# Altium schematic sheet Ticketing_Slave.SchDoc
size A4; Author: Mario Dos Santos; Organization: ETML-ES; Address1: Avenue Recordon 1; Address2: 1004 Lausanne; Address3: Switzerland; Revision: C; SheetNumber: 1; SheetTotal: 5
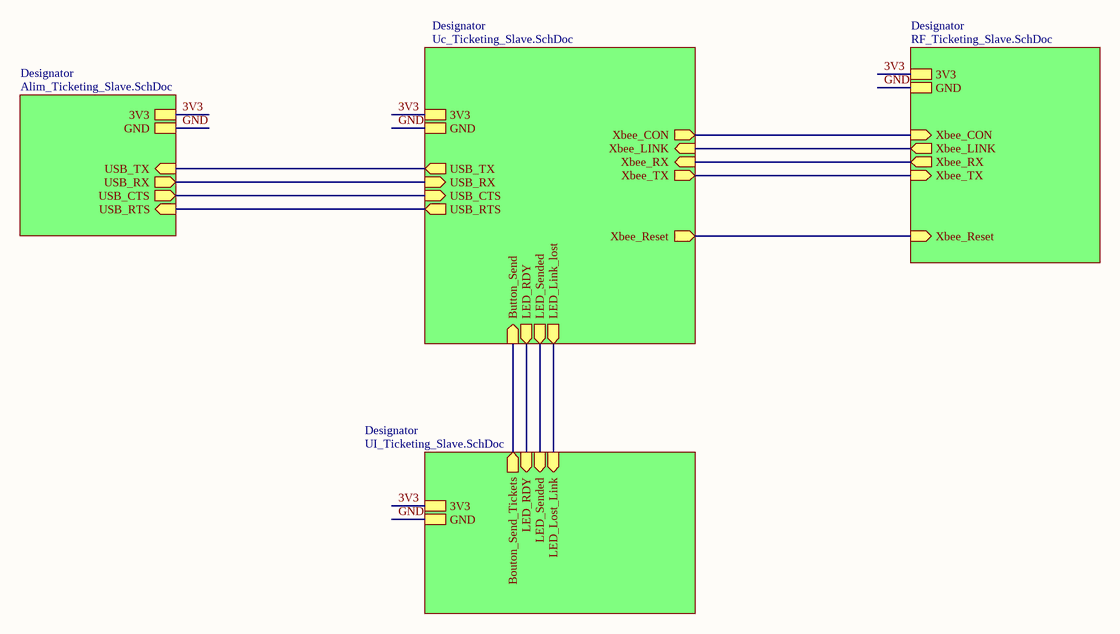
[diagram p0: Ticketing_Slave.SchDoc]

## Sub-sheets
Designator = Uc_Ticketing_Slave.SchDoc: 3V3, GND, Xbee_CON (out), Xbee_LINK (in), Xbee_RX (in), Xbee_TX (out), Button_Send (in), LED_Link_lost (out), LED_Sended (out), LED_RDY (out), Xbee_Reset (out), USB_TX (out), USB_RX (in), USB_CTS (in), USB_RTS (out)
Designator = RF_Ticketing_Slave.SchDoc: GND, Xbee_Reset (in), Xbee_CON (in), 3V3, Xbee_LINK (out), Xbee_RX (out), Xbee_TX (in)
Designator = UI_Ticketing_Slave.SchDoc: 3V3, GND, LED_RDY (in), LED_Sended (in), LED_Lost_Link (in), Bouton_Send_Tickets (out)
Designator = Alim_Ticketing_Slave.SchDoc: GND, 3V3, USB_TX (in), USB_RX (out), USB_CTS (out), USB_RTS (in)

## Nets
3V3: sheet Designator/3V3, sheet Designator/3V3, sheet Designator/3V3, sheet Designator/3V3
GND: sheet Designator/GND, sheet Designator/GND, sheet Designator/GND, sheet Designator/GND
(unnamed): sheet Designator/Xbee_CON, sheet Designator/Xbee_CON
(unnamed): sheet Designator/Xbee_LINK, sheet Designator/Xbee_LINK
(unnamed): sheet Designator/Xbee_RX, sheet Designator/Xbee_RX
(unnamed): sheet Designator/Xbee_TX, sheet Designator/Xbee_TX
(unnamed): sheet Designator/Button_Send, sheet Designator/Bouton_Send_Tickets
(unnamed): sheet Designator/LED_Link_lost, sheet Designator/LED_Lost_Link
(unnamed): sheet Designator/LED_Sended, sheet Designator/LED_Sended
(unnamed): sheet Designator/LED_RDY, sheet Designator/LED_RDY
(unnamed): sheet Designator/Xbee_Reset, sheet Designator/Xbee_Reset
(unnamed): sheet Designator/USB_TX, sheet Designator/USB_TX
(unnamed): sheet Designator/USB_RX, sheet Designator/USB_RX
(unnamed): sheet Designator/USB_CTS, sheet Designator/USB_CTS
(unnamed): sheet Designator/USB_RTS, sheet Designator/USB_RTS

## Notes on the sheet
- Fichier :
- a
- Date :
- Heure :
- Version :
- Auteur :
- Modif.
- b
- c
- d
- Projet :
- No :
- Nb feuilles
- Feuille n°
- Chemin :